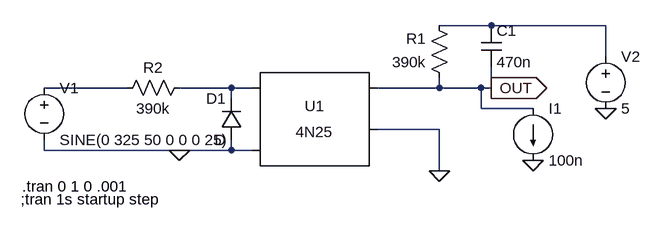
[diagram p0: schematic opto.asc]
opto.asc, the LTspice schematic file:
Version 4
SHEET 1 880 680
WIRE 464 16 384 16
WIRE 640 16 464 16
WIRE 640 64 640 16
WIRE -96 112 -224 112
WIRE 64 112 -16 112
WIRE 96 112 64 112
WIRE 384 112 384 96
WIRE 384 112 288 112
WIRE 448 112 384 112
WIRE 464 112 464 80
WIRE 464 112 448 112
WIRE 64 128 64 112
WIRE 448 144 448 112
WIRE 528 144 448 144
WIRE 384 176 288 176
WIRE -224 208 -224 192
WIRE -16 208 -224 208
WIRE 64 208 64 192
WIRE 64 208 -16 208
WIRE 96 208 64 208
WIRE 384 240 384 176
FLAG 384 240 0
FLAG 640 144 0
FLAG 464 112 OUT
IOPIN 464 112 Out
FLAG -16 208 0
FLAG 528 224 0
SYMBOL Optos\\4N25 192 176 R0
SYMATTR InstName U1
SYMBOL res 400 112 R180
WINDOW 0 36 76 Left 2
WINDOW 3 36 40 Left 2
SYMATTR InstName R1
SYMATTR Value 390k
SYMBOL res 0 96 R90
WINDOW 0 0 56 VBottom 2
WINDOW 3 32 56 VTop 2
SYMATTR InstName R2
SYMATTR Value 390k
SYMBOL diode 80 192 R180
WINDOW 0 24 64 Left 2
WINDOW 3 24 0 Left 2
SYMATTR InstName D1
SYMBOL cap 448 16 R0
SYMATTR InstName C1
SYMATTR Value 470n
SYMBOL voltage -224 96 R0
WINDOW 123 0 0 Left 0
WINDOW 39 0 0 Left 0
SYMATTR InstName V1
SYMATTR Value SINE(0 325 50 0 0 0 25)
SYMBOL voltage 640 48 R0
WINDOW 123 0 0 Left 0
WINDOW 39 0 0 Left 0
SYMATTR InstName V2
SYMATTR Value 5
SYMBOL current 528 144 R0
WINDOW 123 0 0 Left 0
WINDOW 39 0 0 Left 0
SYMATTR InstName I1
SYMATTR Value 100n
TEXT -258 264 Left 2 !.tran 0 1 0 .001
TEXT -260 284 Left 2 !;tran 1s startup step

The netlist it stands for:
* opto.asc
XU1 N003 0 OUT 0 NC_01 4N25
R1 OUT N001 390k
R2 N003 N002 390k
D1 0 N003 D
C1 N001 OUT 470n
V1 N002 0 SINE(0 325 50 0 0 0 25)
V2 N001 0 5
I1 OUT 0 100n
.model D D
.lib standard.dio
.tran 0 1 0 .001
;tran 1s startup step
.lib 4N25.sub
.backanno
.end